# Altium project CubeSat-Backplane.PrjPcb (part 1 of 2)
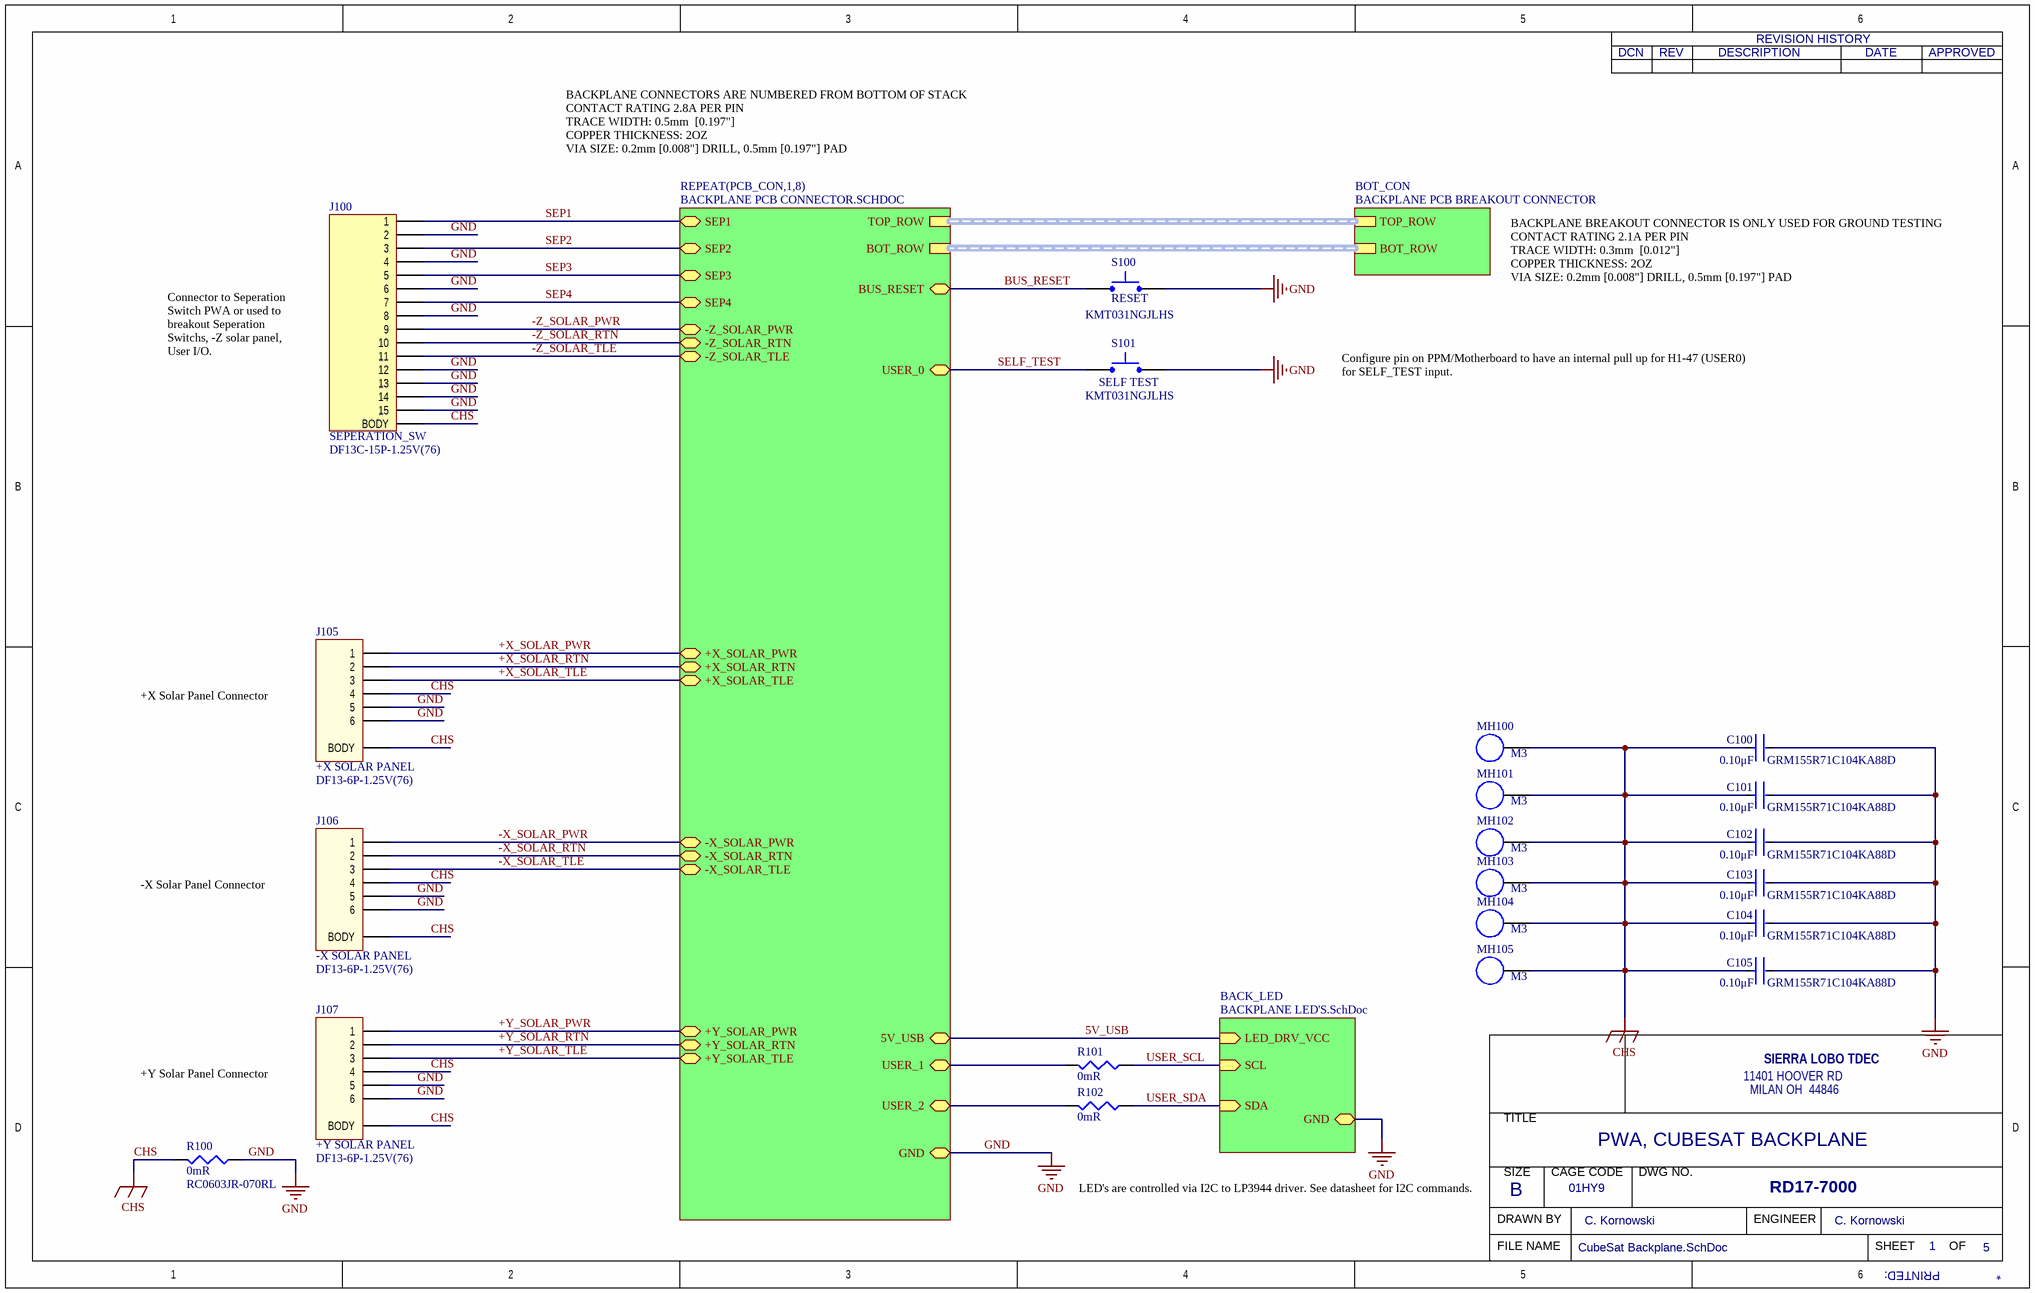
[diagram p0: CubeSat Backplane.SchDoc]
5 sheets, 46 parts. Net scope: hierarchical (ports join the sheet entries above them; power ports are global).
Board file: CubeSat Backplane.PcbDoc
Sheets:
  CubeSat Backplane.SchDoc
    PCB_CON1 = Backplane PCB Connector.SchDoc
    PCB_CON2 = Backplane PCB Connector.SchDoc
    PCB_CON3 = Backplane PCB Connector.SchDoc
    PCB_CON4 = Backplane PCB Connector.SchDoc
    PCB_CON5 = Backplane PCB Connector.SchDoc
    PCB_CON6 = Backplane PCB Connector.SchDoc
    PCB_CON7 = Backplane PCB Connector.SchDoc
    PCB_CON8 = Backplane PCB Connector.SchDoc
    BACK_LED = Backplane LED's.SchDoc
  Backplane PCB End Connector.SchDoc
  LED DRIVER.SchDoc

## Sheet CubeSat Backplane.SchDoc: PWA, CUBESAT BACKPLANE
size B; DrawnBy: C. Kornowski; Engineer: C. Kornowski; Organization: SIERRA LOBO TDEC; Address1: 11401 HOOVER RD; Address2: MILAN OH  44846; DocumentNumber: RD17-7000; Revision: INIT; SheetNumber: 1; SheetTotal: 5; PageSetup: Record=PageOptions|CenterHorizontal=True|CenterVertical=True|PrintScale=1.09|XCorrection=1.00|YCorrection=1.00|PrintKind=1|BorderSize=5000000|LeftOffset=0|BottomOffset=0|Orientation=2|PaperLength=1000|PaperWidth=1000|Scale=100|PaperSource=7|PrintQuality=600|MediaType=1|DitherType=10|PaperKind=11x17|PrintScaleMode=1

### Parts
C100  GRM155R71C104KA88D  Capacitance: 0.10μF  [FP-GRM15-MFG]
C101  GRM155R71C104KA88D  Capacitance: 0.10μF  [FP-GRM15-MFG]
C102  GRM155R71C104KA88D  Capacitance: 0.10μF  [FP-GRM15-MFG]
C103  GRM155R71C104KA88D  Capacitance: 0.10μF  [FP-GRM15-MFG]
C104  GRM155R71C104KA88D  Capacitance: 0.10μF  [FP-GRM15-MFG]
C105  GRM155R71C104KA88D  Capacitance: 0.10μF  [FP-GRM15-MFG]
J100  SEPERATION_SW  Manufacturer Part Number: DF13C-15P-1.25V(76)  [DF13-15P-1.25H(75)]
J105  +X SOLAR PANEL  [DF13-6P-1.25V(75)]
J106  -X SOLAR PANEL  [DF13-6P-1.25V(75)]
J107  +Y SOLAR PANEL  [DF13-6P-1.25V(75)]
MH100  M3  [M3_NPTH/W PAD]  (no BOM)
MH101  M3  [M3_NPTH/W PAD]  (no BOM)
MH102  M3  [M3_NPTH/W PAD]  (no BOM)
MH103  M3  [M3_NPTH/W PAD]  (no BOM)
MH104  M3  [M3_NPTH/W PAD]  (no BOM)
MH105  M3  [M3_NPTH/W PAD]  (no BOM)
R100  0mR  Manufacturer Part Number 1: RC0603JR-070RL  [0603]
R101  0mR  [0603]
R102  0mR  [0603]
S100  RESET  Manufacturer Part Number 1: KMT031NGJLHS  [KMT031 NGJ LHS]
S101  SELF TEST  Manufacturer Part Number 1: KMT031NGJLHS  [KMT031 NGJ LHS]

### Sub-sheets
BACK_LED = BACKPLANE LED'S.SchDoc: SCL (in), SDA (in), LED_DRV_VCC (in), GND (bidir)
BOT_CON = BACKPLANE PCB BREAKOUT CONNECTOR (file not in this document): TOP_ROW (harness TOP), BOT_ROW (harness BOT)
REPEAT(PCB_CON,1,8) = BACKPLANE PCB CONNECTOR.SCHDOC: BOT_ROW (harness BOT), TOP_ROW (harness TOP), GND (bidir), BUS_RESET (bidir), USER_0 (bidir), SEP1 (bidir), SEP2 (bidir), SEP3 (bidir), SEP4 (bidir), -Z_SOLAR_PWR (bidir), -Z_SOLAR_RTN (bidir), -Z_SOLAR_TLE (bidir), +X_SOLAR_PWR (bidir), +X_SOLAR_RTN (bidir), +X_SOLAR_TLE (bidir), -X_SOLAR_PWR (bidir), -X_SOLAR_RTN (bidir), -X_SOLAR_TLE (bidir), +Y_SOLAR_PWR (bidir), +Y_SOLAR_RTN (bidir), +Y_SOLAR_TLE (bidir), 5V_USB (bidir), USER_1 (bidir), USER_2 (bidir)

### Nets
CHS: C100.2 C101.2 C102.2 C103.2 C104.2 C105.2 J100.B(BODY) J105.4 J105.B(BODY) J106.4 J106.B(BODY) J107.4 J107.B(BODY) MH100.MH MH101.MH MH102.MH MH103.MH MH104.MH MH105.MH R100.2
GND: C100.1 C101.1 C102.1 C103.1 C104.1 C105.1 J100.2 J100.4 J100.6 J100.8 J100.12 J100.13 J100.14 J100.15 J105.5 J105.6 J106.5 J106.6 J107.5 J107.6 R100.1 S100.2 S101.2 ; sheet REPEAT(PCB_CON,1,8)/GND, sheet BACK_LED/GND
5V_USB: sheet REPEAT(PCB_CON,1,8)/5V_USB, sheet BACK_LED/LED_DRV_VCC
+X_SOLAR_PWR: J105.1 ; sheet REPEAT(PCB_CON,1,8)/+X_SOLAR_PWR
+X_SOLAR_RTN: J105.2 ; sheet REPEAT(PCB_CON,1,8)/+X_SOLAR_RTN
+X_SOLAR_TLE: J105.3 ; sheet REPEAT(PCB_CON,1,8)/+X_SOLAR_TLE
+Y_SOLAR_PWR: J107.1 ; sheet REPEAT(PCB_CON,1,8)/+Y_SOLAR_PWR
+Y_SOLAR_RTN: J107.2 ; sheet REPEAT(PCB_CON,1,8)/+Y_SOLAR_RTN
+Y_SOLAR_TLE: J107.3 ; sheet REPEAT(PCB_CON,1,8)/+Y_SOLAR_TLE
-X_SOLAR_PWR: J106.1 ; sheet REPEAT(PCB_CON,1,8)/-X_SOLAR_PWR
-X_SOLAR_RTN: J106.2 ; sheet REPEAT(PCB_CON,1,8)/-X_SOLAR_RTN
-X_SOLAR_TLE: J106.3 ; sheet REPEAT(PCB_CON,1,8)/-X_SOLAR_TLE
-Z_SOLAR_PWR: J100.9 ; sheet REPEAT(PCB_CON,1,8)/-Z_SOLAR_PWR
-Z_SOLAR_RTN: J100.10 ; sheet REPEAT(PCB_CON,1,8)/-Z_SOLAR_RTN
-Z_SOLAR_TLE: J100.11 ; sheet REPEAT(PCB_CON,1,8)/-Z_SOLAR_TLE
BUS_RESET: S100.1 ; sheet REPEAT(PCB_CON,1,8)/BUS_RESET
SELF_TEST: S101.1 ; sheet REPEAT(PCB_CON,1,8)/USER_0
SEP1: J100.1 ; sheet REPEAT(PCB_CON,1,8)/SEP1
SEP2: J100.3 ; sheet REPEAT(PCB_CON,1,8)/SEP2
SEP3: J100.5 ; sheet REPEAT(PCB_CON,1,8)/SEP3
SEP4: J100.7 ; sheet REPEAT(PCB_CON,1,8)/SEP4
USER_1: R101.2 ; sheet REPEAT(PCB_CON,1,8)/USER_1
USER_2: R102.2 ; sheet REPEAT(PCB_CON,1,8)/USER_2
USER_SCL: R101.1 ; sheet BACK_LED/SCL  [project net SCL]
USER_SDA: R102.1 ; sheet BACK_LED/SDA  [project net SDA]

### Buses and harness runs
harness sheet BOT_CON/BOT_ROW = sheet REPEAT(PCB_CON,1,8)/BOT_ROW
harness sheet BOT_CON/TOP_ROW = sheet REPEAT(PCB_CON,1,8)/TOP_ROW

### Notes on the sheet
- BACKPLANE CONNECTORS ARE NUMBERED FROM BOTTOM OF STACK
  CONTACT RATING 2.8A PER PIN
  TRACE WIDTH: 0.5mm  [0.197"]
  COPPER THICKNESS: 2OZ
  VIA SIZE: 0.2mm [0.008"] DRILL, 0.5mm [0.197"] PAD
- BACKPLANE BREAKOUT CONNECTOR IS ONLY USED FOR GROUND TESTING
  CONTACT RATING 2.1A PER PIN
  TRACE WIDTH: 0.3mm  [0.012"]
  COPPER THICKNESS: 2OZ
  VIA SIZE: 0.2mm [0.008"] DRILL, 0.5mm [0.197"] PAD
- Connector to Seperation Switch PWA or used to breakout Seperation Switchs, -Z solar panel, User I/O.
- Configure pin on PPM/Motherboard to have an internal pull up for H1-47 (USER0) for SELF_TEST input.
- +X Solar Panel Connector
- -X Solar Panel Connector
- +Y Solar Panel Connector
- LED's are controlled via I2C to LP3944 driver. See datasheet for I2C commands.
- DCN
- REV
- DESCRIPTION
- REVISION HISTORY
- DATE
- APPROVED
- SIZE
- TITLE
- CAGE CODE
- DWG NO.
- DRAWN BY
- B
- 01HY9
- ENGINEER
- FILE NAME
- SHEET
- PRINTED:
- OF

### Library data of the parts
C100-C105 = CMP-2100-03641-2: CAP CER 0.1UF 16V X7R 0402; Manufacturer: Murata; Standoff Height: 0mm; Tolerance: 10%; Voltage Rating: 16Vdc; Material: Ceramic; Value: 0.10μF; Insulation Resistance: 10GR; RoHS: TRUE; Manufacturer Part Number: GRM155R71C104KA88D; Temperature Characteristic: X7R; Octopart: https://octopart.com/grm155r71c104ka88d-murata-196880; Digikey Description: CAP CER 0.1UF 16V X7R 0402; Device Class L3: Ceramic Capacitors; Height: 0.55mm; ComponentLink2Description: Datasheet; Temperature Range Low: -55°C; Ipc Land Pattern Name: CAPC10050X219; ComponentLink2URL: https://search.murata.co.jp/Ceramy/image/img/A01X/G101/ENG/GRM155R71H471KA01-01A.pdf; Device Class L1: Passive Components; Lead Free: yes; Category: Cap; Package: GRM15; Temperature: -55°C to +125°C; Device Class L2: Capacitors; Temperature Range High: +125°C; Mouser Description: 0402 0.1 uF 16V ±10 % Tolerance X7R SMT Multilayer Ceramic Capacitor; Supplier 1: Digi-Key; Supplier Part Number 1: 490-3261-1-ND; Stock 1: 161805; Pricing 1: 1=0.10000, 10=0.02200, 50=0.01180, 100=0.00960, 500=0.00684, 1000=0.00538, 2500=0.00489, 5000=0.00450 (USD); Mount: Surface Mount; Case/Package: 0402; Number of Pins: 2; Case Code (Metric): 1005; Case Code (Imperial): 0402; Dielectric Material: Ceramic; Min Operating Temperature: -55°C; Max Operating Temperature: 125°C; Packaging: Tape and Reel; Package Quantity: 1; Dielectric: X7R; Termination: SMD/SMT; Voltage Rating (DC): 16V; Voltage: 16V; Length: 1mm; Width: 0.5mm; Depth: 0.5mm; Thickness: 0.022inch; Radiation Hardening: No; REACH SVHC: No SVHC; RoHS Compliant: Yes; ComponentLink1URL: https://datasheet.ciiva.com/129/grm155r71c104ka88-01-129739.pdf?src-supplier=Digi-Key; ComponentLink1Description: https://datasheet.ciiva.com/129/grm155r71c104ka88-01-129739.pdf?src-supplier=Digi-Key; ComponentLink3URL: https://datasheet.ciiva.com/129/grm155r71c104ka88-01-129740.pdf?src-supplier=Digi-Key; ComponentLink3Description: https://datasheet.ciiva.com/129/grm155r71c104ka88-01-129740.pdf?src-supplier=Digi-Key; ComponentLink4URL: https://datasheet.ciiva.com/18102/getdatasheetpartid-85307-18102905.pdf?src-supplier=Verical; ComponentLink4Description: https://datasheet.ciiva.com/18102/getdatasheetpartid-85307-18102905.pdf?src-supplier=Verical; ComponentLink5URL: https://datasheet.ciiva.com/29199/454098-da-01-en-vs-kondensator-0402-29199799.pdf?src-supplier=Conrad; ComponentLink5Description: https://datasheet.ciiva.com/29199/454098-da-01-en-vs-kondensator-0402-29199799.pdf?src-supplier=Conrad; ComponentLink6URL: https://datasheet.ciiva.com/14103/grmseries-highdielectrictype-eng-14103750.pdf?src-supplier=Distrelec; ComponentLink6Description: https://datasheet.ciiva.com/14103/grmseries-highdielectrictype-eng-14103750.pdf?src-supplier=Distrelec; ComponentLink7URL: https://datasheet.ciiva.com/14116/grmseries-highdielectrictype-eng-14116878.pdf?src-supplier=Distrelec; ComponentLink7Description: https://datasheet.ciiva.com/14116/grmseries-highdielectrictype-eng-14116878.pdf?src-supplier=Distrelec; ComponentLink8URL: https://datasheet.ciiva.com/16199/product-16199000.pdf?src-supplier=Future+Electronics; ComponentLink8Description: https://datasheet.ciiva.com/16199/product-16199000.pdf?src-supplier=Future+Electronics; ComponentLink9URL: https://datasheet.ciiva.com/28534/4360-28534127.pdf?src-supplier=Element14; ComponentLink9Description: https://datasheet.ciiva.com/28534/4360-28534127.pdf?src-supplier=Element14; ComponentLink10URL: https://datasheet.ciiva.com/28534/4360-28534133.pdf?src-supplier=Element14; ComponentLink10Description: https://datasheet.ciiva.com/28534/4360-28534133.pdf?src-supplier=Element14; ComponentLink11URL: https://datasheet.ciiva.com/7937/4360-7937615.pdf?src-supplier=Element14; ComponentLink11Description: https://datasheet.ciiva.com/7937/4360-7937615.pdf?src-supplier=Element14
J100 = DF13C-15P-1.25x: CONN HEADER SMD R/A 15POS 1.25MM; Manufacturer: Hirose; Connector Type: Header,Male Pin; Number of Positions: 15; Current Rating: 1A; Voltage Rating: 150V; Supplier 1: Digi-Key; RoHS: No; Category: Connectors; Stock 1: 228; Pricing 1: 1=1.61000, 20=1.46000, 80=1.25138, 440=1.04282, 960=0.89385, 4900=0.79255, 9800=0.77467 (USD); Mount: Surface Mount; Contact Plating: Gold; Contact Material: Brass; Contact Shape: Square; Insulation Material: Nylon; Insulation Color: Beige; Min Operating Temperature: -35°C; Max Operating Temperature: 85°C; Fastening Type: Detent; Packaging: Rail/Tube; Number of Rows: 1; Termination: Solder; Flammability Rating: UL94 V-0; ComponentLink1URL: https://www.hirose.com/product/en/download_file/key_name/DF13/category/Catalog/doc_file_id/31687/?file_category_id=4&amp;item_id=38&amp;is_series=1&src-supplier=Digi-Key; ComponentLink1Description: https://www.hirose.com/product/en/download_file/key_name/DF13/category/Catalog/doc_file_id/31687/?file_category_id=4&amp;item_id=38&amp;is_series=1&src-supplier=Digi-Key; Supplier 2: Digi-Key; Stock 2: 124; Pricing 2: 1=0.91000, 20=0.76700, 80=0.68888, 440=0.56359, 960=0.50096, 4900=0.43834, 9800=0.41642 (USD); RoHS Compliant: Yes; ComponentLink2URL: https://www.hirose.com/product/download/?distributor=digikey&amp;type=2d&amp;lang=en&amp;num=DF13-15P-1.25H(75)&src-supplier=Digi-Key; ComponentLink2Description: https://www.hirose.com/product/download/?distributor=digikey&amp;type=2d&amp;lang=en&amp;num=DF13-15P-1.25H(75)&src-supplier=Digi-Key; Supplier Part Number 1: H126460-ND; Supplier Part Number 2: H126385-ND
J105-J107 = DF13-6P-1.25V(76): CONN HEADER SMD 6POS 1.25MM; Manufacturer 1: Hirose; Supplier 1: Digi-Key; Supplier Part Number 1: H126413-ND; Stock 1: 484; Pricing 1: 1=0.90000, 10=0.79100, 100=0.68200, 500=0.55800, 1000=0.49600 (USD); RoHS: No; Manufacturer Part Number 1: DF13-6P-1.25V(76)
MH100-MH105 = Mounting Hole
R100 = RES1: RES SMD 0 OHM JUMPER 1/10W 0603; Manufacturer 1: Yageo; Tolerance: 1%; Voltage Rating: 50V; Power Rating: 100mW; Temperature Coefficient: 200ppm/°C; ComponentLink1URL: https://datasheet.ciiva.com/11808/pyu-r-int-6-11808700.pdf?src-supplier=RSComponents; ComponentLink1Description: https://datasheet.ciiva.com/11808/pyu-r-int-6-11808700.pdf?src-supplier=RSComponents; ComponentLink2URL: https://datasheet.ciiva.com/7746/1738695-7746421.pdf?src-supplier=Element14; ComponentLink2Description: https://datasheet.ciiva.com/7746/1738695-7746421.pdf?src-supplier=Element14; ComponentLink3URL: https://datasheet.ciiva.com/8883/pyu-rc0603-51-rohs-l-4-8883045.pdf?src-supplier=Avnet; ComponentLink3Description: https://datasheet.ciiva.com/8883/pyu-rc0603-51-rohs-l-4-8883045.pdf?src-supplier=Avnet; ComponentLink4URL: https://datasheet.ciiva.com/15189/getdatasheetpartid-329462-15189845.pdf?src-supplier=Verical; ComponentLink4Description: https://datasheet.ciiva.com/15189/getdatasheetpartid-329462-15189845.pdf?src-supplier=Verical; ComponentLink5URL: https://datasheet.ciiva.com/7746/1738695-7746422.pdf?src-supplier=Element14; ComponentLink5Description: https://datasheet.ciiva.com/7746/1738695-7746422.pdf?src-supplier=Element14; ComponentLink6URL: https://datasheet.ciiva.com/12555/rc0603-272842-12555254.pdf?src-supplier=Mouser; ComponentLink6Description: https://datasheet.ciiva.com/12555/rc0603-272842-12555254.pdf?src-supplier=Mouser; ComponentLink7URL: https://datasheet.ciiva.com/22747/443971-22747530.pdf?src-supplier=Element14; ComponentLink7Description: https://datasheet.ciiva.com/22747/443971-22747530.pdf?src-supplier=Element14; Supplier 1: Digi-Key; Supplier Part Number 1: 311-0.0GRCT-ND; Stock 1: 37679871; Pricing 1: 1=0.10000, 10=0.01800, 25=0.01320, 50=0.01000, 100=0.00730, 250=0.00560, 500=0.00448, 1000=0.00329 (USD); RoHS: Yes; Case/Package: 0603; Number of Pins: 2; Case Code (Imperial): 0603; Case Code (Metric): 1608; Contact Plating: Tin,Matte; Min Operating Temperature: -55°C; Max Operating Temperature: 155°C; Package Quantity: 5000; Value: 0mR; Packaging: Tape and Reel; Voltage Rating (DC): 50V; Termination: SMD/SMT; Composition: Thick Film; Military Standard: Not; Length: 1.6mm; Height: 0.45mm; Width: 0.8mm; Depth: 0.8mm; Radiation Hardening: No; REACH SVHC: No SVHC; Lead Free: Lead Free
R101 R102 = RES1: RES SMD 0 OHM JUMPER 1/10W 0603; Manufacturer 1: Yageo; Manufacturer Part Number 1: RC0603JR-070RL; Tolerance: 1%; Voltage Rating: 50V; Power Rating: 100mW; Temperature Coefficient: 200ppm/°C; ComponentLink1URL: https://datasheet.ciiva.com/11808/pyu-r-int-6-11808700.pdf?src-supplier=RSComponents; ComponentLink1Description: https://datasheet.ciiva.com/11808/pyu-r-int-6-11808700.pdf?src-supplier=RSComponents; ComponentLink2URL: https://datasheet.ciiva.com/7746/1738695-7746421.pdf?src-supplier=Element14; ComponentLink2Description: https://datasheet.ciiva.com/7746/1738695-7746421.pdf?src-supplier=Element14; ComponentLink3URL: https://datasheet.ciiva.com/8883/pyu-rc0603-51-rohs-l-4-8883045.pdf?src-supplier=Avnet; ComponentLink3Description: https://datasheet.ciiva.com/8883/pyu-rc0603-51-rohs-l-4-8883045.pdf?src-supplier=Avnet; ComponentLink4URL: https://datasheet.ciiva.com/15189/getdatasheetpartid-329462-15189845.pdf?src-supplier=Verical; ComponentLink4Description: https://datasheet.ciiva.com/15189/getdatasheetpartid-329462-15189845.pdf?src-supplier=Verical; ComponentLink5URL: https://datasheet.ciiva.com/7746/1738695-7746422.pdf?src-supplier=Element14; ComponentLink5Description: https://datasheet.ciiva.com/7746/1738695-7746422.pdf?src-supplier=Element14; ComponentLink6URL: https://datasheet.ciiva.com/12555/rc0603-272842-12555254.pdf?src-supplier=Mouser; ComponentLink6Description: https://datasheet.ciiva.com/12555/rc0603-272842-12555254.pdf?src-supplier=Mouser; ComponentLink7URL: https://datasheet.ciiva.com/22747/443971-22747530.pdf?src-supplier=Element14; ComponentLink7Description: https://datasheet.ciiva.com/22747/443971-22747530.pdf?src-supplier=Element14; Supplier 1: Digi-Key; Supplier Part Number 1: 311-0.0GRCT-ND; Stock 1: 37679871; Pricing 1: 1=0.10000, 10=0.01800, 25=0.01320, 50=0.01000, 100=0.00730, 250=0.00560, 500=0.00448, 1000=0.00329 (USD); RoHS: Yes; Case/Package: 0603; Number of Pins: 2; Case Code (Imperial): 0603; Case Code (Metric): 1608; Contact Plating: Tin,Matte; Min Operating Temperature: -55°C; Max Operating Temperature: 155°C; Package Quantity: 5000; Value: 0mR; Packaging: Tape and Reel; Voltage Rating (DC): 50V; Termination: SMD/SMT; Composition: Thick Film; Military Standard: Not; Length: 1.6mm; Height: 0.45mm; Width: 0.8mm; Depth: 0.8mm; Radiation Hardening: No; REACH SVHC: No SVHC; Lead Free: Lead Free
S100 S101 = Tactile_Switch: SWITCH TACTILE SPST-NO 0.05A 32V; Manufacturer 1: ITT C&K; Mechanical Life: 300000Cycles; Throw Configuration: SPST; Max Current Rating: 50mA; Operating Force: 3.4N; Power Rating: 500mW; Illumination Type: Non-Illuminated; Switch Travel: 0.15mm; Switch Function: Off-Mom; Actuator Type: Standard; Ratings: IP68,Waterproof,Dust Tight; Supplier 1: Future Electronics; Supplier Part Number 1: KMT031NGJLHS-CUTT; Stock 1: 20000; Pricing 1: 1=0.29500, 250=0.21500, 750=0.19900, 1500=0.19200, 2500=0.18600 (USD); RoHS: Yes; Mount: Surface Mount; Case/Package: SMD/SMT; Contact Material: Silver; Contact Plating: Silver; Min Operating Temperature: -40°C; Max Operating Temperature: 85°C; Packaging: Tape and Reel; Package Quantity: 1; Current Rating: 50mA; Voltage Rating (DC): 32V; Max Voltage Rating (DC): 32V; Termination: J-Lead; Orientation: Straight; Length: 2.6mm; Depth: 3.4mm; Radiation Hardening: No; REACH SVHC: No SVHC; ComponentLink1URL: https://datasheet.ciiva.com/2901/kmt-0xx-ngj-lhs-drawing-2901011.pdf?src-supplier=Digi-Key; ComponentLink1Description: https://datasheet.ciiva.com/2901/kmt-0xx-ngj-lhs-drawing-2901011.pdf?src-supplier=Digi-Key; ComponentLink2URL: https://datasheet.ciiva.com/2901/kmt-0xx-ngj-lhs-drawing-2901012.pdf?src-supplier=Digi-Key; ComponentLink2Description: https://datasheet.ciiva.com/2901/kmt-0xx-ngj-lhs-drawing-2901012.pdf?src-supplier=Digi-Key; ComponentLink3URL: https://datasheet.ciiva.com/2901/kmt-0xx-ngj-lhs-drawing-2901013.pdf?src-supplier=Digi-Key; ComponentLink3Description: https://datasheet.ciiva.com/2901/kmt-0xx-ngj-lhs-drawing-2901013.pdf?src-supplier=Digi-Key; ComponentLink4URL: https://datasheet.ciiva.com/22712/1443640-22712103.pdf?src-supplier=Element14; ComponentLink4Description: https://datasheet.ciiva.com/22712/1443640-22712103.pdf?src-supplier=Element14; ComponentLink5URL: https://datasheet.ciiva.com/18145/getdatasheetpartid-320373-18145244.pdf?src-supplier=Verical; ComponentLink5Description: https://datasheet.ciiva.com/18145/getdatasheetpartid-320373-18145244.pdf?src-supplier=Verical

## Sheet Backplane PCB Connector.SchDoc: CUBESAT BACKPLANE PCB CONNECTOR
size B; CompanyName: ENGINEERING & TECHNICAL SERVICES; DrawnBy: C. Kornowski; Engineer: C. Kornowski; Organization: TECHNOLOGY DEVELOPMENT & ENGINEERING CENTER; Address1: 11401 HOOVER ROAD; Address2: MILAN, OH  44846; DocumentNumber: RD17-7000; Revision: INIT; SheetNumber: 2; SheetTotal: 5; PageSetup: Record=PageOptions|CenterHorizontal=True|CenterVertical=True|PrintScale=1.09|XCorrection=1.00|YCorrection=1.00|PrintKind=1|BorderSize=5000000|LeftOffset=0|BottomOffset=0|Orientation=2|PaperLength=1000|PaperWidth=1000|Scale=100|PaperSource=7|PrintQuality=600|MediaType=1|DitherType=10|PaperKind=11x17|PrintScaleMode=1
Used 8 times, as channels PCB_CON1, PCB_CON2, PCB_CON3, PCB_CON4, PCB_CON5, PCB_CON6, PCB_CON7, PCB_CON8. Parts and nets are listed once, with the designators drawn on the sheet.
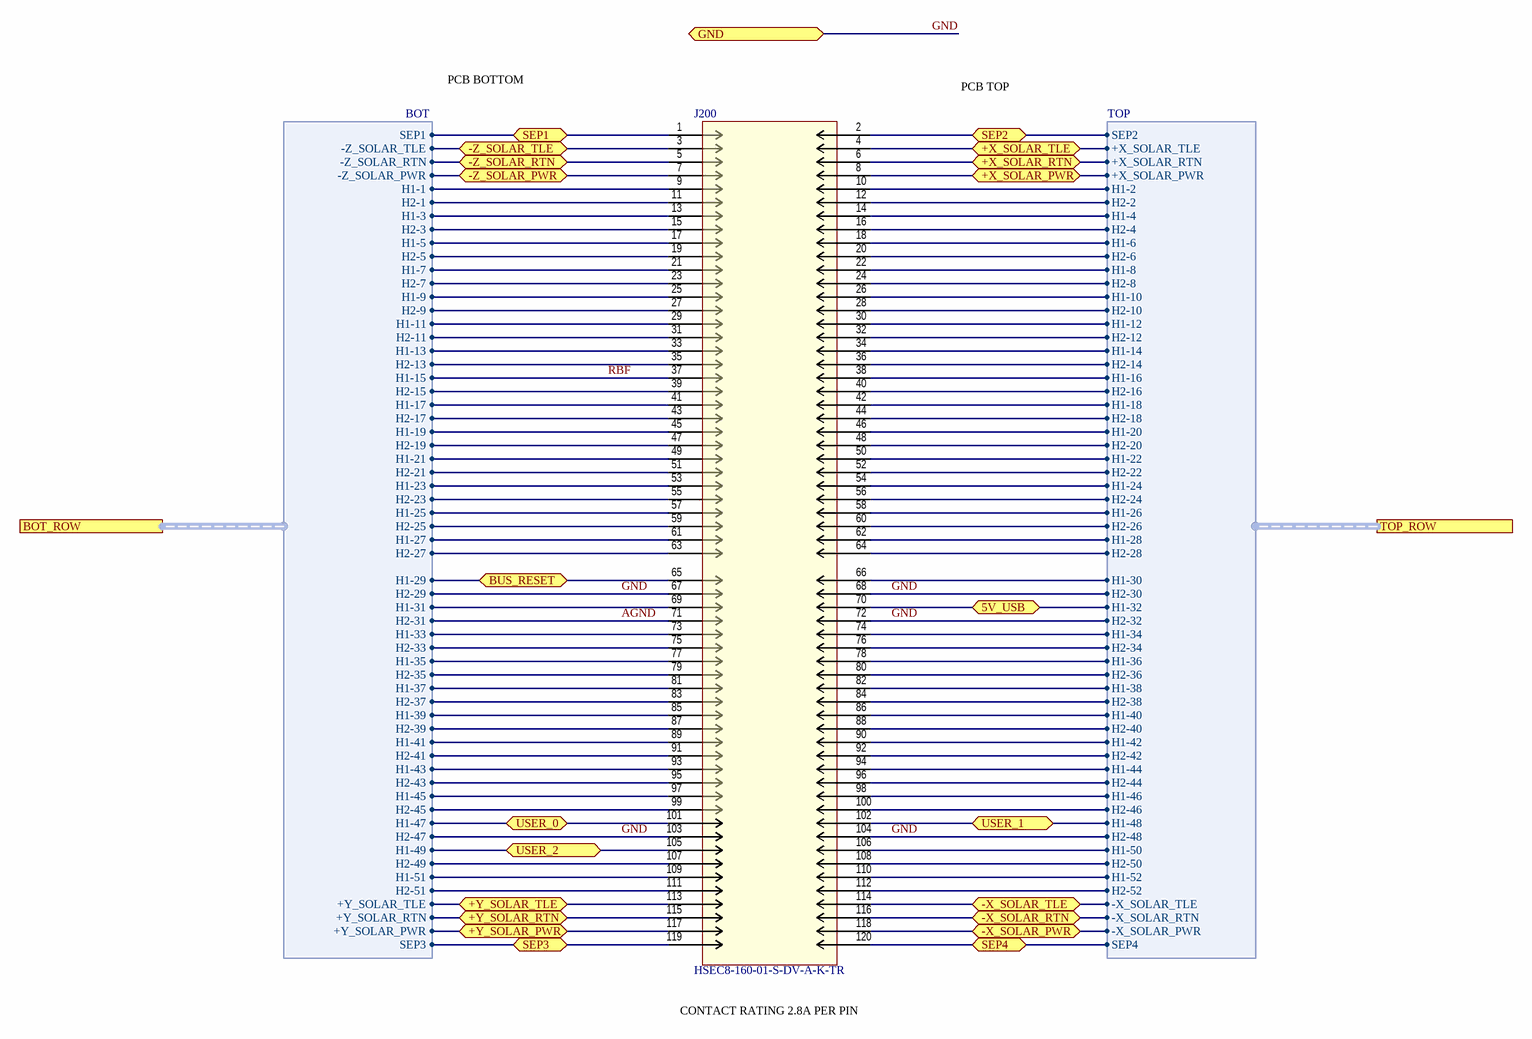
[diagram p1: Backplane PCB Connector.SchDoc]

### Parts
J200  HSEC8-160-01-S-DV-A-K-TR  [HSEC8-160-01-S-DV-A-K-TR]

### Ports
5V_USB (bidir), +X_SOLAR_PWR (bidir), +X_SOLAR_RTN (bidir), +X_SOLAR_TLE (bidir), +Y_SOLAR_PWR (bidir), +Y_SOLAR_RTN (bidir), +Y_SOLAR_TLE (bidir), -X_SOLAR_PWR (bidir), -X_SOLAR_RTN (bidir), -X_SOLAR_TLE (bidir), -Z_SOLAR_PWR (bidir), -Z_SOLAR_RTN (bidir), -Z_SOLAR_TLE (bidir), BOT_ROW (harness BOT), BUS_RESET (bidir), GND (bidir), SEP1 (bidir), SEP2 (bidir), SEP3 (bidir), SEP4 (bidir), TOP_ROW (harness TOP), USER_0 (bidir), USER_1 (bidir), USER_2 (bidir)

### Harnesses
BOT: H1-1, H2-1, H1-3, H2-3, H1-5, H2-5, H1-7, H2-7, H1-9, H2-9, H1-11, H2-11, H1-13, H2-13, H1-15, H2-15, H1-17, H2-17, H1-19, H2-19, H1-21, H2-21, H1-23, H2-23, H1-25, H2-25, H1-27, H2-27, H1-29, H2-29, H1-31, H2-31, H2-33, H1-33, H2-35, H1-35, H2-37, H1-37, H2-39, H1-39, H2-41, H1-41, H2-43, H1-43, H2-45, H1-45, H2-47, H1-47, H2-49, H1-49, H2-51, H1-51, SEP1, SEP3, +Y_SOLAR_PWR, +Y_SOLAR_RTN, +Y_SOLAR_TLE, -Z_SOLAR_PWR, -Z_SOLAR_RTN, -Z_SOLAR_TLE
TOP: H1-2, H2-2, H1-4, H2-4, H1-6, H2-6, H1-8, H2-8, H1-10, H2-10, H1-12, H2-12, H1-14, H2-14, H1-16, H2-16, H1-18, H2-18, H1-20, H2-20, H1-22, H2-22, H1-24, H2-24, H1-26, H2-26, H1-28, H2-28, H1-30, H2-30, H2-32, H1-32, H2-34, H1-34, H2-36, H1-36, H2-38, H1-38, H2-40, H1-40, H2-42, H1-42, H2-44, H1-44, H2-46, H1-46, H2-48, H1-48, H2-50, H1-50, H2-52, H1-52, SEP2, SEP4, -X_SOLAR_PWR, -X_SOLAR_RTN, -X_SOLAR_TLE, +X_SOLAR_TLE, +X_SOLAR_RTN, +X_SOLAR_PWR

### Nets
5V_USB: J200.70 ; port 5V_USB, port TOP_ROW.H1-32
+X_SOLAR_PWR: J200.8 ; port +X_SOLAR_PWR, port TOP_ROW.+X_SOLAR_PWR
+X_SOLAR_RTN: J200.6 ; port +X_SOLAR_RTN, port TOP_ROW.+X_SOLAR_RTN
+X_SOLAR_TLE: J200.4 ; port +X_SOLAR_TLE, port TOP_ROW.+X_SOLAR_TLE
+Y_SOLAR_PWR: J200.117 ; port +Y_SOLAR_PWR, port BOT_ROW.+Y_SOLAR_PWR
+Y_SOLAR_RTN: J200.115 ; port +Y_SOLAR_RTN, port BOT_ROW.+Y_SOLAR_RTN
+Y_SOLAR_TLE: J200.113 ; port +Y_SOLAR_TLE, port BOT_ROW.+Y_SOLAR_TLE
-X_SOLAR_PWR: J200.118 ; port -X_SOLAR_PWR, port TOP_ROW.-X_SOLAR_PWR
-X_SOLAR_RTN: J200.116 ; port -X_SOLAR_RTN, port TOP_ROW.-X_SOLAR_RTN
-X_SOLAR_TLE: J200.114 ; port -X_SOLAR_TLE, port TOP_ROW.-X_SOLAR_TLE
-Z_SOLAR_PWR: J200.7 ; port -Z_SOLAR_PWR, port BOT_ROW.-Z_SOLAR_PWR
-Z_SOLAR_RTN: J200.5 ; port -Z_SOLAR_RTN, port BOT_ROW.-Z_SOLAR_RTN
-Z_SOLAR_TLE: J200.3 ; port -Z_SOLAR_TLE, port BOT_ROW.-Z_SOLAR_TLE
AGND: J200.71 ; port BOT_ROW.H2-31
BUS_RESET: J200.65 ; port BUS_RESET, port BOT_ROW.H1-29
GND: J200.67 J200.68 J200.72 J200.103 J200.104 ; port GND, port BOT_ROW.H2-29, port BOT_ROW.H2-47, port TOP_ROW.H2-30, port TOP_ROW.H2-32, port TOP_ROW.H2-48
RBF: J200.37 ; port BOT_ROW.H1-15
SEP1: J200.1 ; port SEP1, port BOT_ROW.SEP1
SEP2: J200.2 ; port SEP2, port TOP_ROW.SEP2
SEP3: J200.119 ; port SEP3, port BOT_ROW.SEP3
SEP4: J200.120 ; port SEP4, port TOP_ROW.SEP4
USER_0: J200.101 ; port USER_0, port BOT_ROW.H1-47
USER_1: J200.102 ; port USER_1, port TOP_ROW.H1-48
USER_2: J200.105 ; port USER_2, port BOT_ROW.H1-49
NetJ200_9: J200.9 ; port BOT_ROW.H1-1
NetJ200_10: J200.10 ; port TOP_ROW.H1-2
NetJ200_11: J200.11 ; port BOT_ROW.H2-1
NetJ200_12: J200.12 ; port TOP_ROW.H2-2
NetJ200_13: J200.13 ; port BOT_ROW.H1-3
NetJ200_14: J200.14 ; port TOP_ROW.H1-4
NetJ200_15: J200.15 ; port BOT_ROW.H2-3
NetJ200_16: J200.16 ; port TOP_ROW.H2-4
NetJ200_17: J200.17 ; port BOT_ROW.H1-5
NetJ200_18: J200.18 ; port TOP_ROW.H1-6
NetJ200_19: J200.19 ; port BOT_ROW.H2-5
NetJ200_20: J200.20 ; port TOP_ROW.H2-6
NetJ200_21: J200.21 ; port BOT_ROW.H1-7
NetJ200_22: J200.22 ; port TOP_ROW.H1-8
NetJ200_23: J200.23 ; port BOT_ROW.H2-7
NetJ200_24: J200.24 ; port TOP_ROW.H2-8
NetJ200_25: J200.25 ; port BOT_ROW.H1-9
NetJ200_26: J200.26 ; port TOP_ROW.H1-10
NetJ200_27: J200.27 ; port BOT_ROW.H2-9
NetJ200_28: J200.28 ; port TOP_ROW.H2-10
NetJ200_29: J200.29 ; port BOT_ROW.H1-11
NetJ200_30: J200.30 ; port TOP_ROW.H1-12
NetJ200_31: J200.31 ; port BOT_ROW.H2-11
NetJ200_32: J200.32 ; port TOP_ROW.H2-12
NetJ200_33: J200.33 ; port BOT_ROW.H1-13
NetJ200_34: J200.34 ; port TOP_ROW.H1-14
NetJ200_35: J200.35 ; port BOT_ROW.H2-13
NetJ200_36: J200.36 ; port TOP_ROW.H2-14
NetJ200_38: J200.38 ; port TOP_ROW.H1-16
NetJ200_39: J200.39 ; port BOT_ROW.H2-15
NetJ200_40: J200.40 ; port TOP_ROW.H2-16
NetJ200_41: J200.41 ; port BOT_ROW.H1-17
NetJ200_42: J200.42 ; port TOP_ROW.H1-18
NetJ200_43: J200.43 ; port BOT_ROW.H2-17
NetJ200_44: J200.44 ; port TOP_ROW.H2-18
NetJ200_45: J200.45 ; port BOT_ROW.H1-19
NetJ200_46: J200.46 ; port TOP_ROW.H1-20
NetJ200_47: J200.47 ; port BOT_ROW.H2-19
NetJ200_48: J200.48 ; port TOP_ROW.H2-20
NetJ200_49: J200.49 ; port BOT_ROW.H1-21
NetJ200_50: J200.50 ; port TOP_ROW.H1-22
NetJ200_51: J200.51 ; port BOT_ROW.H2-21
NetJ200_52: J200.52 ; port TOP_ROW.H2-22
NetJ200_53: J200.53 ; port BOT_ROW.H1-23
NetJ200_54: J200.54 ; port TOP_ROW.H1-24
NetJ200_55: J200.55 ; port BOT_ROW.H2-23
NetJ200_56: J200.56 ; port TOP_ROW.H2-24
NetJ200_57: J200.57 ; port BOT_ROW.H1-25
NetJ200_58: J200.58 ; port TOP_ROW.H1-26
NetJ200_59: J200.59 ; port BOT_ROW.H2-25
NetJ200_60: J200.60 ; port TOP_ROW.H2-26
NetJ200_61: J200.61 ; port BOT_ROW.H1-27
NetJ200_62: J200.62 ; port TOP_ROW.H1-28
NetJ200_63: J200.63 ; port BOT_ROW.H2-27
NetJ200_64: J200.64 ; port TOP_ROW.H2-28
NetJ200_66: J200.66 ; port TOP_ROW.H1-30
NetJ200_69: J200.69 ; port BOT_ROW.H1-31
NetJ200_73: J200.73 ; port BOT_ROW.H1-33
NetJ200_74: J200.74 ; port TOP_ROW.H1-34
NetJ200_75: J200.75 ; port BOT_ROW.H2-33
NetJ200_76: J200.76 ; port TOP_ROW.H2-34
NetJ200_77: J200.77 ; port BOT_ROW.H1-35
NetJ200_78: J200.78 ; port TOP_ROW.H1-36
NetJ200_79: J200.79 ; port BOT_ROW.H2-35
NetJ200_80: J200.80 ; port TOP_ROW.H2-36
NetJ200_81: J200.81 ; port BOT_ROW.H1-37
NetJ200_82: J200.82 ; port TOP_ROW.H1-38
NetJ200_83: J200.83 ; port BOT_ROW.H2-37
NetJ200_84: J200.84 ; port TOP_ROW.H2-38
NetJ200_85: J200.85 ; port BOT_ROW.H1-39
NetJ200_86: J200.86 ; port TOP_ROW.H1-40
NetJ200_87: J200.87 ; port BOT_ROW.H2-39
NetJ200_88: J200.88 ; port TOP_ROW.H2-40
NetJ200_89: J200.89 ; port BOT_ROW.H1-41
NetJ200_90: J200.90 ; port TOP_ROW.H1-42
NetJ200_91: J200.91 ; port BOT_ROW.H2-41
NetJ200_92: J200.92 ; port TOP_ROW.H2-42
NetJ200_93: J200.93 ; port BOT_ROW.H1-43
NetJ200_94: J200.94 ; port TOP_ROW.H1-44
NetJ200_95: J200.95 ; port BOT_ROW.H2-43
NetJ200_96: J200.96 ; port TOP_ROW.H2-44
NetJ200_97: J200.97 ; port BOT_ROW.H1-45
NetJ200_98: J200.98 ; port TOP_ROW.H1-46
NetJ200_99: J200.99 ; port BOT_ROW.H2-45
NetJ200_100: J200.100 ; port TOP_ROW.H2-46
NetJ200_106: J200.106 ; port TOP_ROW.H1-50
NetJ200_107: J200.107 ; port BOT_ROW.H2-49
NetJ200_108: J200.108 ; port TOP_ROW.H2-50
NetJ200_109: J200.109 ; port BOT_ROW.H1-51
NetJ200_110: J200.110 ; port TOP_ROW.H1-52
NetJ200_111: J200.111 ; port BOT_ROW.H2-51
NetJ200_112: J200.112 ; port TOP_ROW.H2-52

### Channels
PCB_CON1: designators end in _1; ports 5V_USB=5V_USB +X_SOLAR_PWR=+X_SOLAR_PWR +X_SOLAR_RTN=+X_SOLAR_RTN +X_SOLAR_TLE=+X_SOLAR_TLE +Y_SOLAR_PWR=+Y_SOLAR_PWR +Y_SOLAR_RTN=+Y_SOLAR_RTN +Y_SOLAR_TLE=+Y_SOLAR_TLE -X_SOLAR_PWR=-X_SOLAR_PWR -X_SOLAR_RTN=-X_SOLAR_RTN -X_SOLAR_TLE=-X_SOLAR_TLE -Z_SOLAR_PWR=-Z_SOLAR_PWR -Z_SOLAR_RTN=-Z_SOLAR_RTN -Z_SOLAR_TLE=-Z_SOLAR_TLE BUS_RESET=BUS_RESET GND=GND SEP1=SEP1 SEP2=SEP2 SEP3=SEP3 SEP4=SEP4 USER_0=SELF_TEST USER_1=USER_1 USER_2=USER_2
PCB_CON2: designators end in _2; ports 5V_USB=5V_USB +X_SOLAR_PWR=+X_SOLAR_PWR +X_SOLAR_RTN=+X_SOLAR_RTN +X_SOLAR_TLE=+X_SOLAR_TLE +Y_SOLAR_PWR=+Y_SOLAR_PWR +Y_SOLAR_RTN=+Y_SOLAR_RTN +Y_SOLAR_TLE=+Y_SOLAR_TLE -X_SOLAR_PWR=-X_SOLAR_PWR -X_SOLAR_RTN=-X_SOLAR_RTN -X_SOLAR_TLE=-X_SOLAR_TLE -Z_SOLAR_PWR=-Z_SOLAR_PWR -Z_SOLAR_RTN=-Z_SOLAR_RTN -Z_SOLAR_TLE=-Z_SOLAR_TLE BUS_RESET=BUS_RESET GND=GND SEP1=SEP1 SEP2=SEP2 SEP3=SEP3 SEP4=SEP4 USER_0=SELF_TEST USER_1=USER_1 USER_2=USER_2
PCB_CON3: designators end in _3; ports 5V_USB=5V_USB +X_SOLAR_PWR=+X_SOLAR_PWR +X_SOLAR_RTN=+X_SOLAR_RTN +X_SOLAR_TLE=+X_SOLAR_TLE +Y_SOLAR_PWR=+Y_SOLAR_PWR +Y_SOLAR_RTN=+Y_SOLAR_RTN +Y_SOLAR_TLE=+Y_SOLAR_TLE -X_SOLAR_PWR=-X_SOLAR_PWR -X_SOLAR_RTN=-X_SOLAR_RTN -X_SOLAR_TLE=-X_SOLAR_TLE -Z_SOLAR_PWR=-Z_SOLAR_PWR -Z_SOLAR_RTN=-Z_SOLAR_RTN -Z_SOLAR_TLE=-Z_SOLAR_TLE BUS_RESET=BUS_RESET GND=GND SEP1=SEP1 SEP2=SEP2 SEP3=SEP3 SEP4=SEP4 USER_0=SELF_TEST USER_1=USER_1 USER_2=USER_2
PCB_CON4: designators end in _4; ports 5V_USB=5V_USB +X_SOLAR_PWR=+X_SOLAR_PWR +X_SOLAR_RTN=+X_SOLAR_RTN +X_SOLAR_TLE=+X_SOLAR_TLE +Y_SOLAR_PWR=+Y_SOLAR_PWR +Y_SOLAR_RTN=+Y_SOLAR_RTN +Y_SOLAR_TLE=+Y_SOLAR_TLE -X_SOLAR_PWR=-X_SOLAR_PWR -X_SOLAR_RTN=-X_SOLAR_RTN -X_SOLAR_TLE=-X_SOLAR_TLE -Z_SOLAR_PWR=-Z_SOLAR_PWR -Z_SOLAR_RTN=-Z_SOLAR_RTN -Z_SOLAR_TLE=-Z_SOLAR_TLE BUS_RESET=BUS_RESET GND=GND SEP1=SEP1 SEP2=SEP2 SEP3=SEP3 SEP4=SEP4 USER_0=SELF_TEST USER_1=USER_1 USER_2=USER_2
PCB_CON5: designators end in _5; ports 5V_USB=5V_USB +X_SOLAR_PWR=+X_SOLAR_PWR +X_SOLAR_RTN=+X_SOLAR_RTN +X_SOLAR_TLE=+X_SOLAR_TLE +Y_SOLAR_PWR=+Y_SOLAR_PWR +Y_SOLAR_RTN=+Y_SOLAR_RTN +Y_SOLAR_TLE=+Y_SOLAR_TLE -X_SOLAR_PWR=-X_SOLAR_PWR -X_SOLAR_RTN=-X_SOLAR_RTN -X_SOLAR_TLE=-X_SOLAR_TLE -Z_SOLAR_PWR=-Z_SOLAR_PWR -Z_SOLAR_RTN=-Z_SOLAR_RTN -Z_SOLAR_TLE=-Z_SOLAR_TLE BUS_RESET=BUS_RESET GND=GND SEP1=SEP1 SEP2=SEP2 SEP3=SEP3 SEP4=SEP4 USER_0=SELF_TEST USER_1=USER_1 USER_2=USER_2
PCB_CON6: designators end in _6; ports 5V_USB=5V_USB +X_SOLAR_PWR=+X_SOLAR_PWR +X_SOLAR_RTN=+X_SOLAR_RTN +X_SOLAR_TLE=+X_SOLAR_TLE +Y_SOLAR_PWR=+Y_SOLAR_PWR +Y_SOLAR_RTN=+Y_SOLAR_RTN +Y_SOLAR_TLE=+Y_SOLAR_TLE -X_SOLAR_PWR=-X_SOLAR_PWR -X_SOLAR_RTN=-X_SOLAR_RTN -X_SOLAR_TLE=-X_SOLAR_TLE -Z_SOLAR_PWR=-Z_SOLAR_PWR -Z_SOLAR_RTN=-Z_SOLAR_RTN -Z_SOLAR_TLE=-Z_SOLAR_TLE BUS_RESET=BUS_RESET GND=GND SEP1=SEP1 SEP2=SEP2 SEP3=SEP3 SEP4=SEP4 USER_0=SELF_TEST USER_1=USER_1 USER_2=USER_2
PCB_CON7: designators end in _7; ports 5V_USB=5V_USB +X_SOLAR_PWR=+X_SOLAR_PWR +X_SOLAR_RTN=+X_SOLAR_RTN +X_SOLAR_TLE=+X_SOLAR_TLE +Y_SOLAR_PWR=+Y_SOLAR_PWR +Y_SOLAR_RTN=+Y_SOLAR_RTN +Y_SOLAR_TLE=+Y_SOLAR_TLE -X_SOLAR_PWR=-X_SOLAR_PWR -X_SOLAR_RTN=-X_SOLAR_RTN -X_SOLAR_TLE=-X_SOLAR_TLE -Z_SOLAR_PWR=-Z_SOLAR_PWR -Z_SOLAR_RTN=-Z_SOLAR_RTN -Z_SOLAR_TLE=-Z_SOLAR_TLE BUS_RESET=BUS_RESET GND=GND SEP1=SEP1 SEP2=SEP2 SEP3=SEP3 SEP4=SEP4 USER_0=SELF_TEST USER_1=USER_1 USER_2=USER_2
PCB_CON8: designators end in _8; ports 5V_USB=5V_USB +X_SOLAR_PWR=+X_SOLAR_PWR +X_SOLAR_RTN=+X_SOLAR_RTN +X_SOLAR_TLE=+X_SOLAR_TLE +Y_SOLAR_PWR=+Y_SOLAR_PWR +Y_SOLAR_RTN=+Y_SOLAR_RTN +Y_SOLAR_TLE=+Y_SOLAR_TLE -X_SOLAR_PWR=-X_SOLAR_PWR -X_SOLAR_RTN=-X_SOLAR_RTN -X_SOLAR_TLE=-X_SOLAR_TLE -Z_SOLAR_PWR=-Z_SOLAR_PWR -Z_SOLAR_RTN=-Z_SOLAR_RTN -Z_SOLAR_TLE=-Z_SOLAR_TLE BUS_RESET=BUS_RESET GND=GND SEP1=SEP1 SEP2=SEP2 SEP3=SEP3 SEP4=SEP4 USER_0=SELF_TEST USER_1=USER_1 USER_2=USER_2

### Notes on the sheet
- PCB BOTTOM
- PCB TOP
- CONTACT RATING 2.8A PER PIN
- DCN
- REV
- DESCRIPTION
- REVISION HISTORY
- DATE
- APPROVED
- SIZE
- TITLE
- CAGE CODE
- DWG NO.
- DRAWN BY
- B
- 01HY9
- ENGINEER
- FILE NAME
- SHEET
- PRINTED:
- OF

### Library data of the parts
J200 = HSEC8-160-01-S-DV-A-K-TR: 120 Position Female Connector Non Specified - Dual Edge Gold 0.031" (0.80mm) Black; Manufacturer 1: Samtec; Max Current Rating: 3.1A; Number of Positions: 120; Connector Type: Cantilever; Pitch: 0.8mm; Card Thickness: 0.062inch; Supplier 1: Digi-Key; Supplier Part Number 1: SAM13191CT-ND; Stock 1: 14; Pricing 1: 1=7.87000, 10=7.53900, 25=6.88400, 50=6.55600, 100=6.22820 (USD); RoHS: Yes; Mount: Surface Mount; Contact Plating: Gold; Contact Material: Copper; Color: Black; Housing Color: Black; Insulation Material: Polymer; Housing Material: Polymer; Min Operating Temperature: -55°C; Max Operating Temperature: 125°C; Packaging: Tape and Reel; Number of Rows: 2; Gender: Female; Termination: Solder; Number of Contacts: 120; Orientation: Straight; Radiation Hardening: No; ComponentLink1URL: https://datasheet.ciiva.com/10924/hsec8-dv-10924587.pdf?src-supplier=Avnet; ComponentLink1Description: https://datasheet.ciiva.com/10924/hsec8-dv-10924587.pdf?src-supplier=Avnet; ComponentLink2URL: https://datasheet.ciiva.com/437/hsec8-1xxx-xx-xx-dv-x-xx-mkt-437503.pdf?src-supplier=Digi-Key; ComponentLink2Description: https://datasheet.ciiva.com/437/hsec8-1xxx-xx-xx-dv-x-xx-mkt-437503.pdf?src-supplier=Digi-Key; ComponentLink3URL: https://datasheet.ciiva.com/16666/hsec8-dv-16666399.pdf?src-supplier=Avnet+Europe; ComponentLink3Description: https://datasheet.ciiva.com/16666/hsec8-dv-16666399.pdf?src-supplier=Avnet+Europe; Manufacturer Part Number 1: HSEC8-160-01-S-DV-A-K-TR; System: Connector

## Sheet Backplane LED's.SchDoc: BACKPLANE LED'S
size B; CompanyName: ENGINEERING & TECHNICAL SERVICES; DrawnBy: C. Kornowski; Engineer: C. Kornowski; Organization: TECHNOLOGY DEVELOPMENT & ENGINEERING CENTER; Address1: 11401 HOOVER ROAD; Address2: MILAN, OH  44846; DocumentNumber: RD17-7000; Revision: INIT; SheetNumber: 4; SheetTotal: 5; PageSetup: Record=PageOptions|CenterHorizontal=True|CenterVertical=True|PrintScale=1.09|XCorrection=1.00|YCorrection=1.00|PrintKind=1|BorderSize=5000000|LeftOffset=0|BottomOffset=0|Orientation=2|PaperLength=1000|PaperWidth=1000|Scale=100|PaperSource=7|PrintQuality=600|MediaType=1|DitherType=10|PaperKind=11x17|PrintScaleMode=1
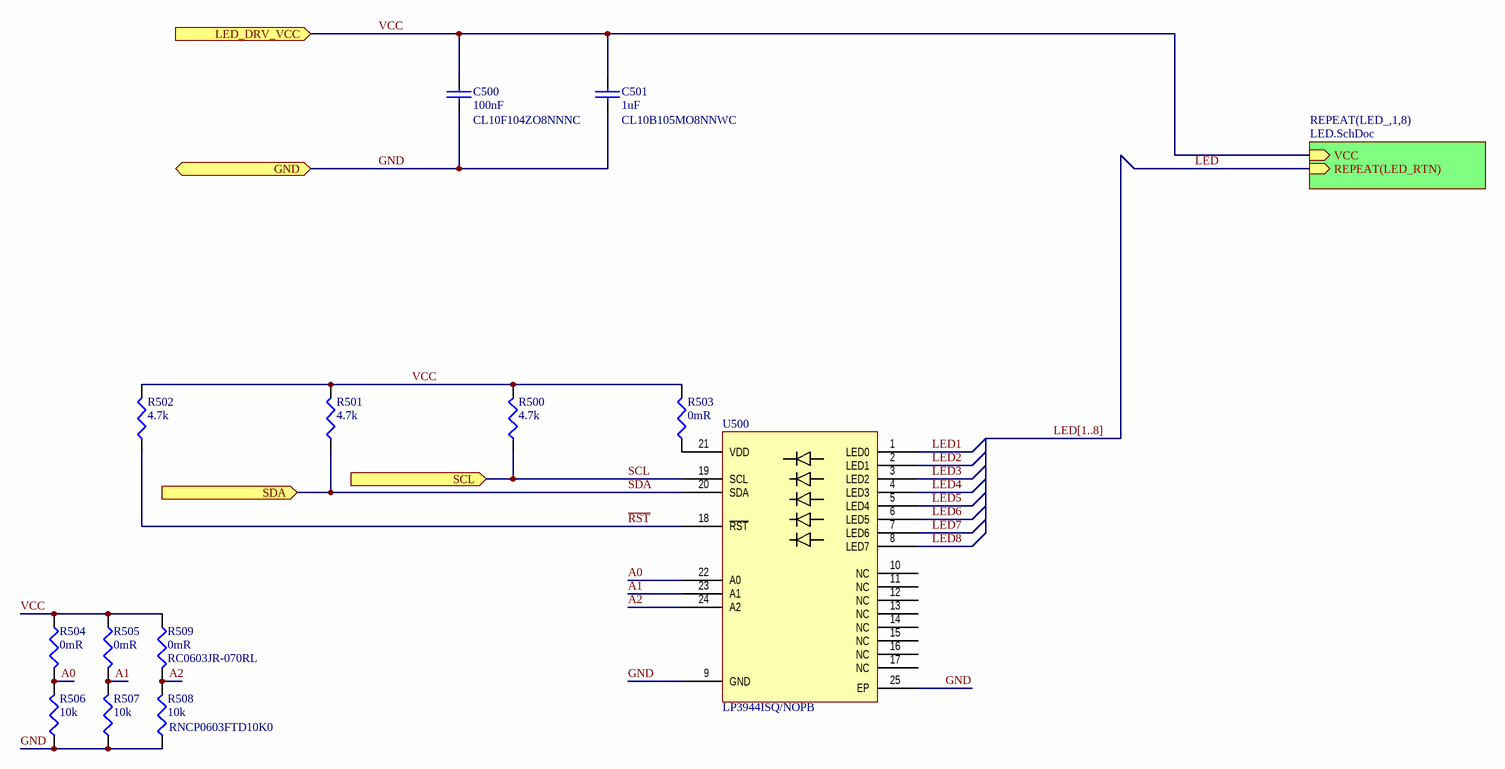
[diagram p2: Backplane LED's.SchDoc]

### Parts
C500  100nF  Manufacturer Part Number 1: CL10F104ZO8NNNC  [0603]
C501  1uF  Manufacturer Part Number 1: CL10B105MO8NNWC  [0603]
R500  4.7k  [RES_603]
R501  4.7k  [RES_603]
R502  4.7k  [RES_603]
R503  0mR  [0603]
R504  0mR  [0603]
R505  0mR  [0603]
R506  10k  [RES_603]
R507  10k  [RES_603]
R508  10k  Mfr. P/N: RNCP0603FTD10K0  [RES_603]
R509  0mR  Manufacturer Part Number 1: RC0603JR-070RL  [0603]
U500  LP3944ISQ/NOPB  [LP3944ISQ/NOPB]

### Sub-sheets
REPEAT(LED_,1,8) = LED.SchDoc (file not in this document): REPEAT(LED_RTN) (in), VCC (in)

### Ports
GND (bidir), LED_DRV_VCC (in), SCL (in), SDA (in)

### Nets
GND: C500.2 C501.2 R506.1 R507.1 R508.1 U500.9(GND) U500.25(EP) ; port GND
A0: R504.2 R506.2 U500.22(A0)
A1: R505.2 R507.2 U500.23(A1)
A2: R508.2 R509.2 U500.24(A2)
LED: sheet REPEAT(LED_,1,8)/REPEAT(LED_RTN)
LED1: U500.1(LED0)
LED2: U500.2(LED1)
LED3: U500.3(LED2)
LED4: U500.4(LED3)
LED5: U500.5(LED4)
LED6: U500.6(LED5)
LED7: U500.7(LED6)
LED8: U500.8(LED7)
~{RST}: R502.1 U500.18(~{RST})
SCL: R500.1 U500.19(SCL) ; port SCL
SDA: R501.1 U500.20(SDA) ; port SDA
VCC: C500.1 C501.1 R500.2 R501.2 R502.2 R503.2 R504.1 R505.1 R509.1 ; port LED_DRV_VCC, sheet REPEAT(LED_,1,8)/VCC  [project net 5V_USB]
NetR503_1: R503.1 U500.21(VDD)

Not connected (* = marked no-connect by the designer): U500 10(NC) 11(NC) 12(NC) 13(NC) 14(NC) 15(NC) 16(NC) 17(NC)

### Buses and harness runs
bus LED[1..8]

### Notes on the sheet
- DCN
- REV
- DESCRIPTION
- REVISION HISTORY
- DATE
- APPROVED
- SIZE
- TITLE
- CAGE CODE
- DWG NO.
- DRAWN BY
- B
- 01HY9
- ENGINEER
- FILE NAME
- SHEET
- PRINTED:
- OF

### Library data of the parts
C500 = CAP: Cap Ceramic 0.1uF 16V Y5V -20% to 80% SMD 0603 85C Paper T/R; Manufacturer 1: Samsung; Digi-Key P/N: *; Material: *; Voltage: *; Manufacturer: *; Supplier 1: Digi-Key; Supplier Part Number 1: 1276-1258-1-ND; Stock 1: 7828239; Pricing 1: 1=0.10000, 10=0.03000, 100=0.01360, 500=0.00970, 1000=0.00762 (USD); RoHS: Yes; Mount: Surface Mount; Case/Package: 0603; Case Code (Metric): 1608; Case Code (Imperial): 0603; Min Operating Temperature: -30°C; Max Operating Temperature: 85°C; Value: 100nF; Tolerance: 80%; Package Quantity: 1; Packaging: Tape and Reel; Voltage Rating: 16V; Dielectric: Y5V; Length: 1.6mm; Height: 0.8mm; Width: 0.031inch; Thickness: 0.035inch; Depth: 0.8mm; Radiation Hardening: No; ComponentLink1URL: https://datasheet.ciiva.com/25805/cl10f104zo8nnnc-25805810.pdf?src-supplier=Digi-Key; ComponentLink1Description: https://datasheet.ciiva.com/25805/cl10f104zo8nnnc-25805810.pdf?src-supplier=Digi-Key; ComponentLink2URL: https://datasheet.ciiva.com/16199/cl10f104zo8nnnc-16199254.pdf?src-supplier=Future+Electronics; ComponentLink2Description: https://datasheet.ciiva.com/16199/cl10f104zo8nnnc-16199254.pdf?src-supplier=Future+Electronics
C501 = CAP: CAP CER 1UF 16V X7R 0603; Manufacturer 1: Samsung; Tolerance: 20%; Digi-Key P/N: *; Material: *; Voltage: *; Manufacturer: *; Supplier 1: Digi-Key; Supplier Part Number 1: 1276-6524-1-ND; Stock 1: 9891972; Pricing 1: 1=0.10000, 10=0.04200, 100=0.01860, 500=0.01330, 1000=0.01045 (USD); RoHS: Yes; Mount: Surface Mount; Case/Package: 0603; Case Code (Metric): 1608; Case Code (Imperial): 0603; Min Operating Temperature: -55°C; Max Operating Temperature: 125°C; Packaging: Tape and Reel; Value: 1uF; Voltage Rating: 16V; Length: 0.063inch; Width: 0.031inch; Thickness: 0.035inch; ComponentLink1URL: http://www.samsungsem.com/kr/support/product-search/mlcc/CL10B105MO8NNWC.jsp?src-supplier=Digi-Key; ComponentLink1Description: http://www.samsungsem.com/kr/support/product-search/mlcc/CL10B105MO8NNWC.jsp?src-supplier=Digi-Key
R500-R502 = RES1: RNCP0603FTD10K0; Mfr. P/N: RMCF0603FT4K70; Resistance: 4.7k
R503-R505 = RES1: as R101 on sheet CubeSat Backplane; ComponentLink1URL: https://datasheet.ciiva.com/11808/pyu-r-int-6-11808700.pdf?src-supplier=RSComponents; ComponentLink1Description: https://datasheet.ciiva.com/11808/pyu-r-int-6-11808700.pdf?src-supplier=RSComponents; ComponentLink2URL: https://datasheet.ciiva.com/7746/1738695-7746421.pdf?src-supplier=Element14; ComponentLink2Description: https://datasheet.ciiva.com/7746/1738695-7746421.pdf?src-supplier=Element14; ComponentLink3URL: https://datasheet.ciiva.com/8883/pyu-rc0603-51-rohs-l-4-8883045.pdf?src-supplier=Avnet; ComponentLink3Description: https://datasheet.ciiva.com/8883/pyu-rc0603-51-rohs-l-4-8883045.pdf?src-supplier=Avnet; ComponentLink4URL: https://datasheet.ciiva.com/15189/getdatasheetpartid-329462-15189845.pdf?src-supplier=Verical; ComponentLink4Description: https://datasheet.ciiva.com/15189/getdatasheetpartid-329462-15189845.pdf?src-supplier=Verical; ComponentLink5URL: https://datasheet.ciiva.com/7746/1738695-7746422.pdf?src-supplier=Element14; ComponentLink5Description: https://datasheet.ciiva.com/7746/1738695-7746422.pdf?src-supplier=Element14; ComponentLink6URL: https://datasheet.ciiva.com/12555/rc0603-272842-12555254.pdf?src-supplier=Mouser; ComponentLink6Description: https://datasheet.ciiva.com/12555/rc0603-272842-12555254.pdf?src-supplier=Mouser; ComponentLink7URL: https://datasheet.ciiva.com/22747/443971-22747530.pdf?src-supplier=Element14; ComponentLink7Description: https://datasheet.ciiva.com/22747/443971-22747530.pdf?src-supplier=Element14; Supplier 1: Digi-Key; Supplier Part Number 1: 311-0.0GRCT-ND; Stock 1: 37679871; Pricing 1: 1=0.10000, 10=0.01800, 25=0.01320, 50=0.01000, 100=0.00730, 250=0.00560, 500=0.00448, 1000=0.00329 (USD); RoHS: Yes; Case/Package: 0603; Number of Pins: 2; Case Code (Imperial): 0603; Case Code (Metric): 1608; Contact Plating: Tin,Matte; Min Operating Temperature: -55°C; Max Operating Temperature: 155°C; Package Quantity: 5000; Value: 0mR; Packaging: Tape and Reel; Voltage Rating (DC): 50V; Termination: SMD/SMT; Composition: Thick Film; Military Standard: Not; Length: 1.6mm; Height: 0.45mm; Width: 0.8mm; Depth: 0.8mm; Radiation Hardening: No; REACH SVHC: No SVHC; Lead Free: Lead Free
R506 R507 = RES1: Mfr. P/N: RNCP0603FTD10K0; Resistance: 10k
R508 = RES1: Resistance: 10k
R509 = RES1: as R100 on sheet CubeSat Backplane; ComponentLink1URL: https://datasheet.ciiva.com/11808/pyu-r-int-6-11808700.pdf?src-supplier=RSComponents; ComponentLink1Description: https://datasheet.ciiva.com/11808/pyu-r-int-6-11808700.pdf?src-supplier=RSComponents; ComponentLink2URL: https://datasheet.ciiva.com/7746/1738695-7746421.pdf?src-supplier=Element14; ComponentLink2Description: https://datasheet.ciiva.com/7746/1738695-7746421.pdf?src-supplier=Element14; ComponentLink3URL: https://datasheet.ciiva.com/8883/pyu-rc0603-51-rohs-l-4-8883045.pdf?src-supplier=Avnet; ComponentLink3Description: https://datasheet.ciiva.com/8883/pyu-rc0603-51-rohs-l-4-8883045.pdf?src-supplier=Avnet; ComponentLink4URL: https://datasheet.ciiva.com/15189/getdatasheetpartid-329462-15189845.pdf?src-supplier=Verical; ComponentLink4Description: https://datasheet.ciiva.com/15189/getdatasheetpartid-329462-15189845.pdf?src-supplier=Verical; ComponentLink5URL: https://datasheet.ciiva.com/7746/1738695-7746422.pdf?src-supplier=Element14; ComponentLink5Description: https://datasheet.ciiva.com/7746/1738695-7746422.pdf?src-supplier=Element14; ComponentLink6URL: https://datasheet.ciiva.com/12555/rc0603-272842-12555254.pdf?src-supplier=Mouser; ComponentLink6Description: https://datasheet.ciiva.com/12555/rc0603-272842-12555254.pdf?src-supplier=Mouser; ComponentLink7URL: https://datasheet.ciiva.com/22747/443971-22747530.pdf?src-supplier=Element14; ComponentLink7Description: https://datasheet.ciiva.com/22747/443971-22747530.pdf?src-supplier=Element14; Supplier 1: Digi-Key; Supplier Part Number 1: 311-0.0GRCT-ND; Stock 1: 37679871; Pricing 1: 1=0.10000, 10=0.01800, 25=0.01320, 50=0.01000, 100=0.00730, 250=0.00560, 500=0.00448, 1000=0.00329 (USD); RoHS: Yes; Case/Package: 0603; Number of Pins: 2; Case Code (Imperial): 0603; Case Code (Metric): 1608; Contact Plating: Tin,Matte; Min Operating Temperature: -55°C; Max Operating Temperature: 155°C; Package Quantity: 5000; Value: 0mR; Packaging: Tape and Reel; Voltage Rating (DC): 50V; Termination: SMD/SMT; Composition: Thick Film; Military Standard: Not; Length: 1.6mm; Height: 0.45mm; Width: 0.8mm; Depth: 0.8mm; Radiation Hardening: No; REACH SVHC: No SVHC; Lead Free: Lead Free
U500 = LP3944ISQ/NOPB: IC LED DRIVER PS DIM 25MA 24WQFN

## Sheet Backplane PCB End Connector.SchDoc: BACKPLANE PCB END CONNECTOR
size B; CompanyName: ENGINEERING & TECHNICAL SERVICES; DrawnBy: C. Kornowski; Engineer: C. Kornowski; Organization: TECHNOLOGY DEVELOPMENT & ENGINEERING CENTER; Address1: 11401 HOOVER ROAD; Address2: MILAN, OH  44846; DocumentNumber: RD17-700*; SheetNumber: 3; PageSetup: Record=PageOptions|CenterHorizontal=True|CenterVertical=True|PrintScale=1.09|XCorrection=1.00|YCorrection=1.00|PrintKind=1|BorderSize=5000000|LeftOffset=0|BottomOffset=0|Orientation=2|PaperLength=1000|PaperWidth=1000|Scale=100|PaperSource=7|PrintQuality=600|MediaType=1|DitherType=10|PaperKind=11x17|PrintScaleMode=1
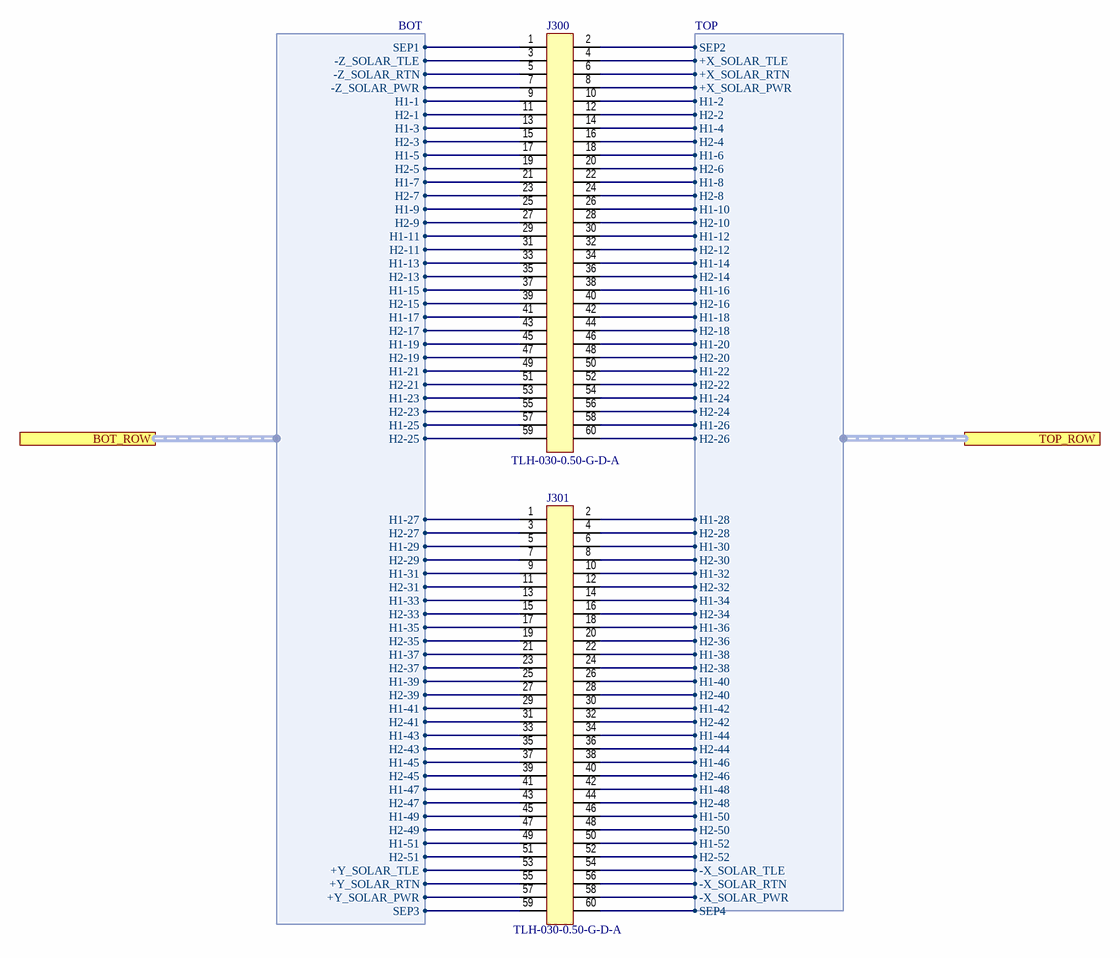
[diagram p3: Backplane PCB End Connector.SchDoc]

### Parts
J300  TLH-030-0.50-G-D-A  [TLH-030-0.50-G-D-A]
J301  TLH-030-0.50-G-D-A  [TLH-030-0.50-G-D-A]

### Ports
BOT_ROW (harness BOT), TOP_ROW (harness TOP)

### Harnesses
BOT: H1-1, H2-1, H1-3, H2-3, H1-5, H2-5, H1-7, H2-7, H1-9, H2-9, H1-11, H2-11, H1-13, H2-13, H1-15, H2-15, H1-17, H2-17, H1-19, H2-19, H1-21, H2-21, H1-23, H2-23, H1-25, H2-25, H1-27, H2-27, H1-29, H2-29, H1-31, H2-31, H2-33, H1-33, H2-35, H1-35, H2-37, H1-37, H2-39, H1-39, H2-41, H1-41, H2-43, H1-43, H2-45, H1-45, H2-47, H1-47, H2-49, H1-49, H2-51, H1-51, SEP1, SEP3, +Y_SOLAR_PWR, +Y_SOLAR_RTN, +Y_SOLAR_TLE, -Z_SOLAR_PWR, -Z_SOLAR_RTN, -Z_SOLAR_TLE
TOP: H1-2, H2-2, H1-4, H2-4, H1-6, H2-6, H1-8, H2-8, H1-10, H2-10, H1-12, H2-12, H1-14, H2-14, H1-16, H2-16, H1-18, H2-18, H1-20, H2-20, H1-22, H2-22, H1-24, H2-24, H1-26, H2-26, H1-28, H2-28, H1-30, H2-30, H2-32, H1-32, H2-34, H1-34, H2-36, H1-36, H2-38, H1-38, H2-40, H1-40, H2-42, H1-42, H2-44, H1-44, H2-46, H1-46, H2-48, H1-48, H2-50, H1-50, H2-52, H1-52, SEP2, SEP4, -X_SOLAR_PWR, -X_SOLAR_RTN, -X_SOLAR_TLE, +X_SOLAR_TLE, +X_SOLAR_RTN, +X_SOLAR_PWR

### Nets
NetJ300_1: J300.1 ; port BOT_ROW.SEP1
NetJ300_2: J300.2 ; port TOP_ROW.SEP2
NetJ300_3: J300.3 ; port BOT_ROW.-Z_SOLAR_TLE
NetJ300_4: J300.4 ; port TOP_ROW.+X_SOLAR_TLE
NetJ300_5: J300.5 ; port BOT_ROW.-Z_SOLAR_RTN
NetJ300_6: J300.6 ; port TOP_ROW.+X_SOLAR_RTN
NetJ300_7: J300.7 ; port BOT_ROW.-Z_SOLAR_PWR
NetJ300_8: J300.8 ; port TOP_ROW.+X_SOLAR_PWR
NetJ300_9: J300.9 ; port BOT_ROW.H1-1
NetJ300_10: J300.10 ; port TOP_ROW.H1-2
NetJ300_11: J300.11 ; port BOT_ROW.H2-1
NetJ300_12: J300.12 ; port TOP_ROW.H2-2
NetJ300_13: J300.13 ; port BOT_ROW.H1-3
NetJ300_14: J300.14 ; port TOP_ROW.H1-4
NetJ300_15: J300.15 ; port BOT_ROW.H2-3
NetJ300_16: J300.16 ; port TOP_ROW.H2-4
NetJ300_17: J300.17 ; port BOT_ROW.H1-5
NetJ300_18: J300.18 ; port TOP_ROW.H1-6
NetJ300_19: J300.19 ; port BOT_ROW.H2-5
NetJ300_20: J300.20 ; port TOP_ROW.H2-6
NetJ300_21: J300.21 ; port BOT_ROW.H1-7
NetJ300_22: J300.22 ; port TOP_ROW.H1-8
NetJ300_23: J300.23 ; port BOT_ROW.H2-7
NetJ300_24: J300.24 ; port TOP_ROW.H2-8
NetJ300_25: J300.25 ; port BOT_ROW.H1-9
NetJ300_26: J300.26 ; port TOP_ROW.H1-10
NetJ300_27: J300.27 ; port BOT_ROW.H2-9
NetJ300_28: J300.28 ; port TOP_ROW.H2-10
NetJ300_29: J300.29 ; port BOT_ROW.H1-11
NetJ300_30: J300.30 ; port TOP_ROW.H1-12
NetJ300_31: J300.31 ; port BOT_ROW.H2-11
NetJ300_32: J300.32 ; port TOP_ROW.H2-12
NetJ300_33: J300.33 ; port BOT_ROW.H1-13
NetJ300_34: J300.34 ; port TOP_ROW.H1-14
NetJ300_35: J300.35 ; port BOT_ROW.H2-13
NetJ300_36: J300.36 ; port TOP_ROW.H2-14
NetJ300_37: J300.37 ; port BOT_ROW.H1-15
NetJ300_38: J300.38 ; port TOP_ROW.H1-16
NetJ300_39: J300.39 ; port BOT_ROW.H2-15
NetJ300_40: J300.40 ; port TOP_ROW.H2-16
NetJ300_41: J300.41 ; port BOT_ROW.H1-17
NetJ300_42: J300.42 ; port TOP_ROW.H1-18
NetJ300_43: J300.43 ; port BOT_ROW.H2-17
NetJ300_44: J300.44 ; port TOP_ROW.H2-18
NetJ300_45: J300.45 ; port BOT_ROW.H1-19
NetJ300_46: J300.46 ; port TOP_ROW.H1-20
NetJ300_47: J300.47 ; port BOT_ROW.H2-19
NetJ300_48: J300.48 ; port TOP_ROW.H2-20
NetJ300_49: J300.49 ; port BOT_ROW.H1-21
NetJ300_50: J300.50 ; port TOP_ROW.H1-22
NetJ300_51: J300.51 ; port BOT_ROW.H2-21
NetJ300_52: J300.52 ; port TOP_ROW.H2-22
NetJ300_53: J300.53 ; port BOT_ROW.H1-23
NetJ300_54: J300.54 ; port TOP_ROW.H1-24
NetJ300_55: J300.55 ; port BOT_ROW.H2-23
NetJ300_56: J300.56 ; port TOP_ROW.H2-24
NetJ300_57: J300.57 ; port BOT_ROW.H1-25
NetJ300_58: J300.58 ; port TOP_ROW.H1-26
NetJ300_59: J300.59 ; port BOT_ROW.H2-25
NetJ300_60: J300.60 ; port TOP_ROW.H2-26
NetJ301_1: J301.1 ; port BOT_ROW.H1-27
NetJ301_2: J301.2 ; port TOP_ROW.H1-28
NetJ301_3: J301.3 ; port BOT_ROW.H2-27
NetJ301_4: J301.4 ; port TOP_ROW.H2-28
NetJ301_5: J301.5 ; port BOT_ROW.H1-29
NetJ301_6: J301.6 ; port TOP_ROW.H1-30
NetJ301_7: J301.7 ; port BOT_ROW.H2-29
NetJ301_8: J301.8 ; port TOP_ROW.H2-30
NetJ301_9: J301.9 ; port BOT_ROW.H1-31
NetJ301_10: J301.10 ; port TOP_ROW.H1-32
NetJ301_11: J301.11 ; port BOT_ROW.H2-31
NetJ301_12: J301.12 ; port TOP_ROW.H2-32
NetJ301_13: J301.13 ; port BOT_ROW.H1-33
NetJ301_14: J301.14 ; port TOP_ROW.H1-34
NetJ301_15: J301.15 ; port BOT_ROW.H2-33
NetJ301_16: J301.16 ; port TOP_ROW.H2-34
NetJ301_17: J301.17 ; port BOT_ROW.H1-35
NetJ301_18: J301.18 ; port TOP_ROW.H1-36
NetJ301_19: J301.19 ; port BOT_ROW.H2-35
NetJ301_20: J301.20 ; port TOP_ROW.H2-36
NetJ301_21: J301.21 ; port BOT_ROW.H1-37
NetJ301_22: J301.22 ; port TOP_ROW.H1-38
NetJ301_23: J301.23 ; port BOT_ROW.H2-37
NetJ301_24: J301.24 ; port TOP_ROW.H2-38
NetJ301_25: J301.25 ; port BOT_ROW.H1-39
NetJ301_26: J301.26 ; port TOP_ROW.H1-40
NetJ301_27: J301.27 ; port BOT_ROW.H2-39
NetJ301_28: J301.28 ; port TOP_ROW.H2-40
NetJ301_29: J301.29 ; port BOT_ROW.H1-41
NetJ301_30: J301.30 ; port TOP_ROW.H1-42
NetJ301_31: J301.31 ; port BOT_ROW.H2-41
NetJ301_32: J301.32 ; port TOP_ROW.H2-42
NetJ301_33: J301.33 ; port BOT_ROW.H1-43
NetJ301_34: J301.34 ; port TOP_ROW.H1-44
NetJ301_35: J301.35 ; port BOT_ROW.H2-43
NetJ301_36: J301.36 ; port TOP_ROW.H2-44
NetJ301_37: J301.37 ; port BOT_ROW.H1-45
NetJ301_38: J301.38 ; port TOP_ROW.H1-46
NetJ301_39: J301.39 ; port BOT_ROW.H2-45
NetJ301_40: J301.40 ; port TOP_ROW.H2-46
NetJ301_41: J301.41 ; port BOT_ROW.H1-47
NetJ301_42: J301.42 ; port TOP_ROW.H1-48
NetJ301_43: J301.43 ; port BOT_ROW.H2-47
NetJ301_44: J301.44 ; port TOP_ROW.H2-48
NetJ301_45: J301.45 ; port BOT_ROW.H1-49
NetJ301_46: J301.46 ; port TOP_ROW.H1-50
NetJ301_47: J301.47 ; port BOT_ROW.H2-49
NetJ301_48: J301.48 ; port TOP_ROW.H2-50
NetJ301_49: J301.49 ; port BOT_ROW.H1-51
NetJ301_50: J301.50 ; port TOP_ROW.H1-52
NetJ301_51: J301.51 ; port BOT_ROW.H2-51
NetJ301_52: J301.52 ; port TOP_ROW.H2-52
NetJ301_53: J301.53 ; port BOT_ROW.+Y_SOLAR_TLE
NetJ301_54: J301.54 ; port TOP_ROW.-X_SOLAR_TLE
NetJ301_55: J301.55 ; port BOT_ROW.+Y_SOLAR_RTN
NetJ301_56: J301.56 ; port TOP_ROW.-X_SOLAR_RTN
NetJ301_57: J301.57 ; port BOT_ROW.+Y_SOLAR_PWR
NetJ301_58: J301.58 ; port TOP_ROW.-X_SOLAR_PWR
NetJ301_59: J301.59 ; port BOT_ROW.SEP3
NetJ301_60: J301.60 ; port TOP_ROW.SEP4

### Notes on the sheet
- DCN
- REV
- DESCRIPTION
- REVISION HISTORY
- DATE
- APPROVED
- SIZE
- TITLE
- CAGE CODE
- DWG NO.
- DRAWN BY
- B
- 01HY9
- ENGINEER
- FILE NAME
- SHEET
- PRINTED:
- OF

### Library data of the parts
J300 J301 = TLH-030-0.50-G-D-A: Board to Board & Mezzanine Connectors 0.50 mm Razor Beam LP Ultra Low Profile Terminal Strip; Manufacturer 1: Samtec; Supplier 1: Avnet; Supplier Part Number 1: TLH-030-0.50-G-D-A; Stock 1: 0; Pricing 1: 1=4.48781, 10=4.38095, 25=4.28572, 50=4.18816, 100=3.93162 (USD); RoHS: No; Manufacturer Part Number 1: TLH-030-0.50-G-D-A; System: Connector